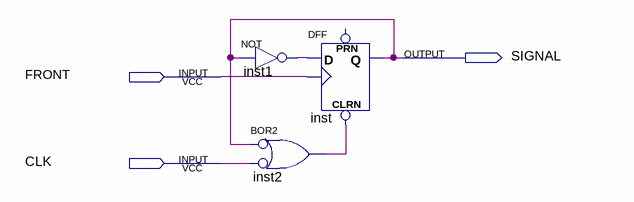
[diagram p0: schematic sheet]
// Quartus schematic FRONT_TO_SIGNAL.bdf as structural Verilog: 3 symbols, 3 pins
module FRONT_TO_SIGNAL (
  input  FRONT,
  input  CLK,
  output SIGNAL
);

  wire inst1_out, inst2_out;

  not inst1 (inst1_out, SIGNAL);
  or inst2 (inst2_out, ~SIGNAL, ~CLK);  // BOR2
  DFF inst (.CLRN(inst2_out), .CLK(FRONT), .D(inst1_out), .Q(SIGNAL));  // open: PRN
endmodule
